# Altium project WiWi_SDR.PrjPcb (part 5 of 5)
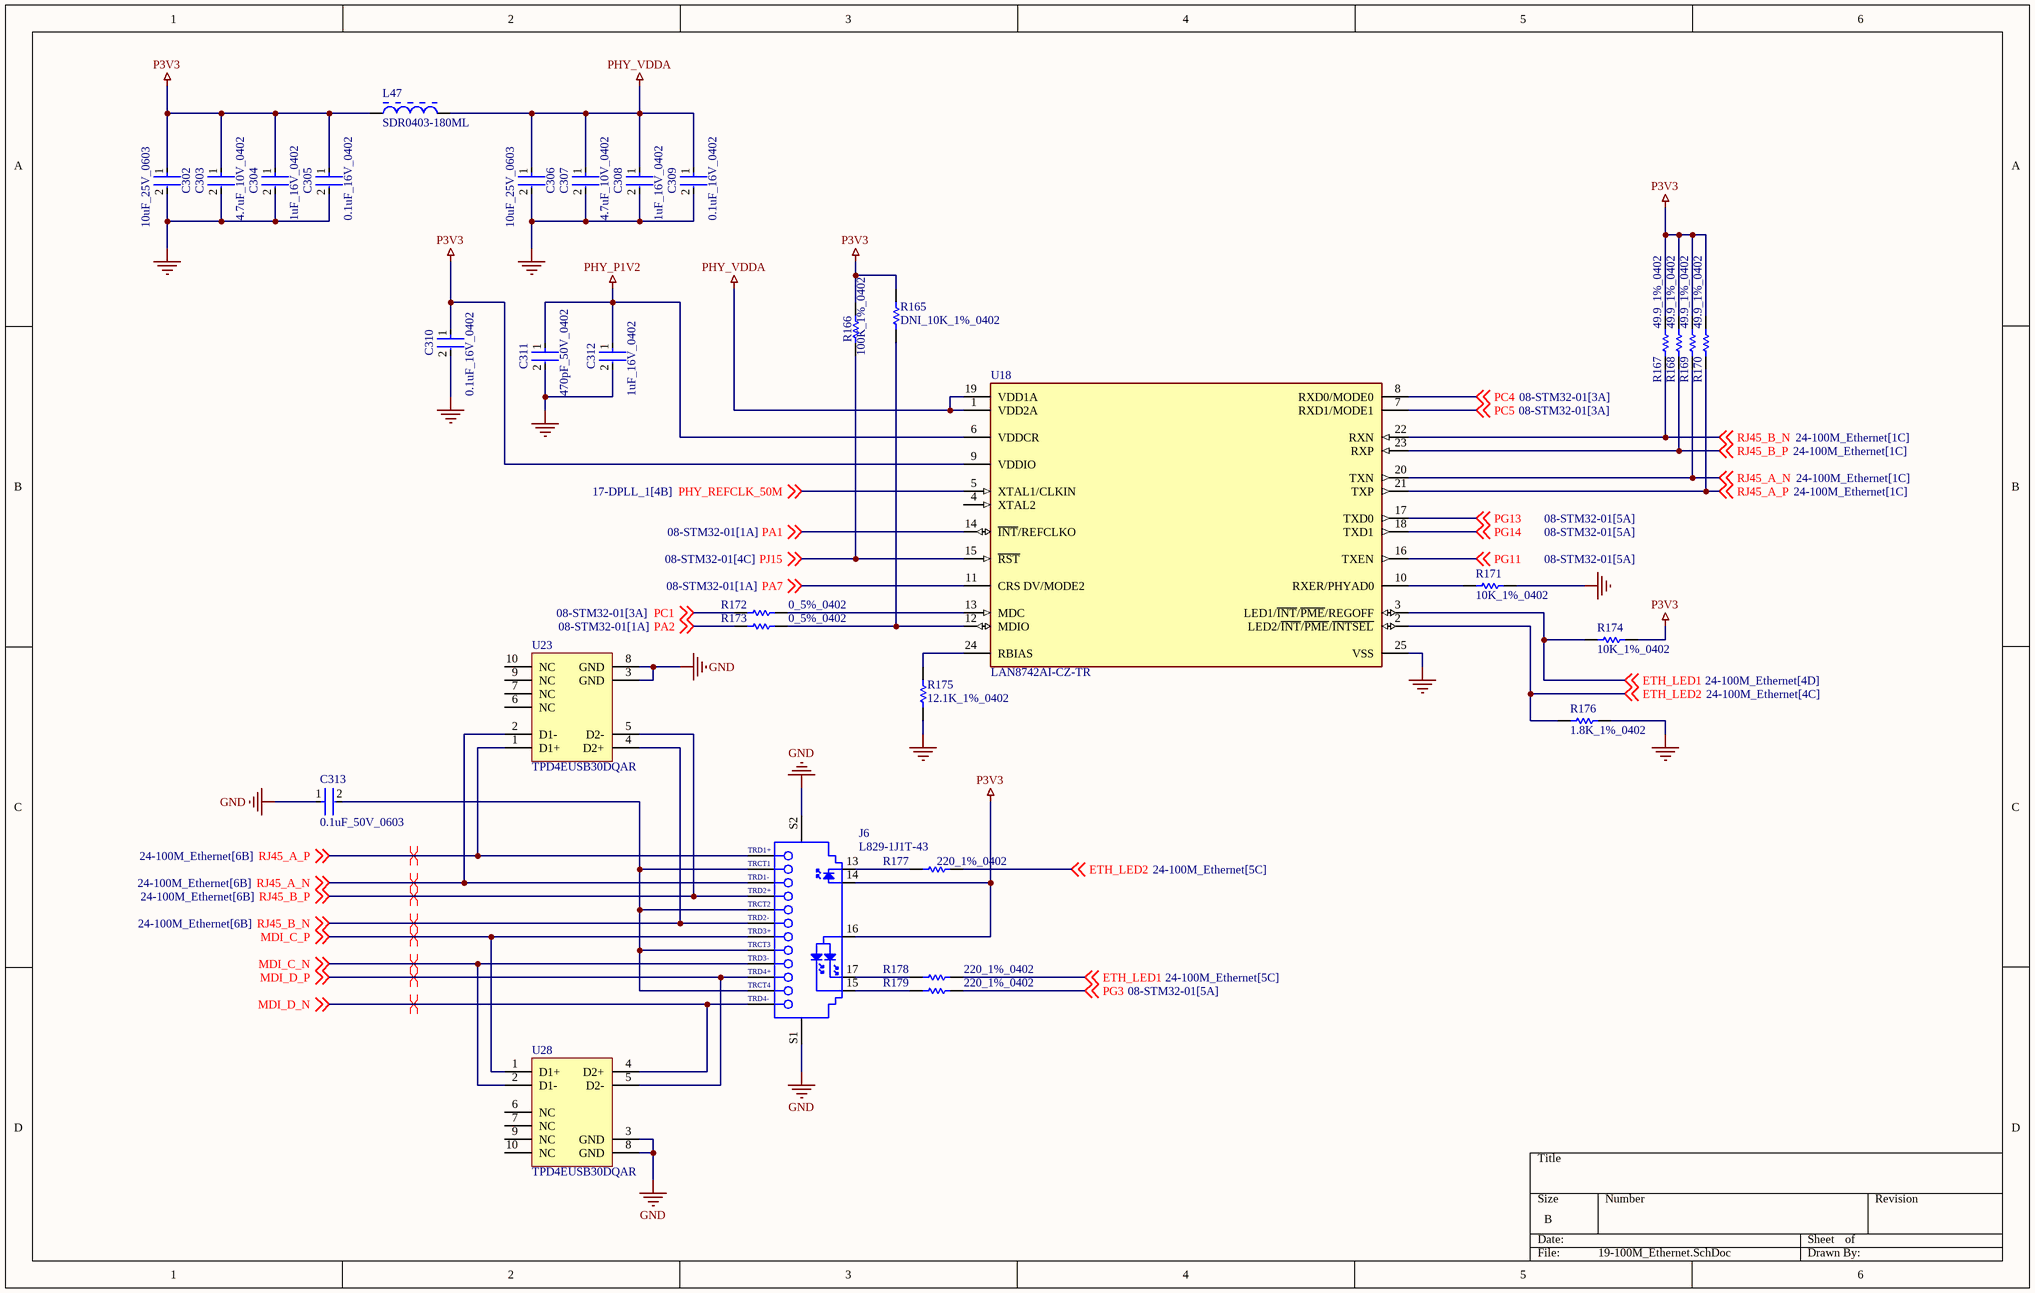
[diagram p16: 19-100M_Ethernet.SchDoc]

## Nets that join several sheets
FPGA_P2V5: 12-FPGA_Power (6 pins), 17-ECP5_FPGA_2 (14 pins)
FPGA_VCC: 11-Power (5 pins), 17-ECP5_FPGA_2 (15 pins)
GND: 01-Antennas (28 pins), 02-RCB_Header (C208.2 R41.1 SW1.1), 04-AT86RF215IQ (39 pins), 05-AT86RF215IQ-FEM (57 pins), 06-SX1276 (31 pins), 07-TCXO_Crystal (12 pins), 08-STM32-01 (P5.1 P5.2 Q5.2), 10-USB-Prog (20 pins), 11-Power (38 pins), 12-FPGA_Power (11 pins), 13-ESP32S3 (37 pins), 14-DPLL_1 (57 pins), 16-ECP5_FPGA_1 (7 pins), 17-ECP5_FPGA_2 (61 pins), 18-USB_HS (11 pins), 19-100M_Ethernet (22 pins)
P1V8: 11-Power (5 pins), 18-USB_HS (C300.1 C301.1 U3.28 U3.30)
P3V3: 01-Antennas (8 pins), 02-RCB_Header (R22.2 SW2.2), 04-AT86RF215IQ (7 pins), 05-AT86RF215IQ-FEM (16 pins), 06-SX1276 (16 pins), 07-TCXO_Crystal (12 pins), 08-STM32-01 (D2.2 R20.2), 11-Power (11 pins), 12-FPGA_Power (7 pins), 13-ESP32S3 (20 pins), 14-DPLL_1 (16 pins), 16-ECP5_FPGA_1 (C184.1 D1.2 U15.1), 17-ECP5_FPGA_2 (40 pins), 18-USB_HS (7 pins), 19-100M_Ethernet (16 pins)
VIN: 05-AT86RF215IQ-FEM (5 pins), 10-USB-Prog (6 pins), 11-Power (23 pins)
32768HZ_OUT: 07-TCXO_Crystal (Y2.2), 08-STM32-01 (U7.C2)
BOOT: 02-RCB_Header (R41.2 SW2.1), 08-STM32-01 (R42.2 U7.E8)
DPLL_A0: 08-STM32-01 (U7.P15), 14-DPLL_1 (R35.1 U4.L3 U4.M3)
DPLL_A1: 08-STM32-01 (U7.U16), 14-DPLL_1 (R36.1 U4.M2)
DPLL_CLKIN_1_N: 14-DPLL_1 (U4.C2), 16-ECP5_FPGA_1 (U11.T15)
DPLL_CLKIN_2_N: 14-DPLL_1 (U4.D2), 16-ECP5_FPGA_1 (U11.R15)
DPLL_CLKIN_2_P: 14-DPLL_1 (U4.D1), 16-ECP5_FPGA_1 (U11.A8)
DPLL_CLKIN_3_N: 14-DPLL_1 (U4.E2), 16-ECP5_FPGA_1 (U11.P14)
DPLL_CLKIN_3_P: 14-DPLL_1 (U4.E1), 16-ECP5_FPGA_1 (U11.E5)
DPLL_CLKIN_7_P: 13-ESP32S3 (U24.14), 14-DPLL_1 (U4.J1)
DPLL_CLKOUT0_P: 14-DPLL_1 (U4.A8), 16-ECP5_FPGA_1 (R111.1)
DPLL_CLKOUT1_P: 13-ESP32S3 (R124.1), 14-DPLL_1 (U4.A9)
DPLL_CLKOUT2_P: 14-DPLL_1 (U4.A11), 16-ECP5_FPGA_1 (R145.1)
DPLL_CLKOUT3_P: 04-AT86RF215IQ (R6.1), 14-DPLL_1 (U4.A12)
DPLL_CLKOUT4_P: 06-SX1276 (U12.5), 14-DPLL_1 (U4.M12)
DPLL_CLKOUT5_P: 14-DPLL_1 (U4.M11), 16-ECP5_FPGA_1 (R147.1)
DPLL_CLKOUT10_P: 14-DPLL_1 (U4.H12), 18-USB_HS (R163.1)
DPLL_GPIO4: 14-DPLL_1 (U4.B10), 16-ECP5_FPGA_1 (U11.A10)
DPLL_GPIO5: 14-DPLL_1 (U4.D11), 16-ECP5_FPGA_1 (U11.B10)
DPLL_GPIO10_CLK14: 14-DPLL_1 (U4.M5), 16-ECP5_FPGA_1 (U11.C10)
DPLL_RESET: 08-STM32-01 (U7.E12), 14-DPLL_1 (C7.1 R64.2 U4.L10)
DPLL_SCL: 08-STM32-01 (U7.D5), 14-DPLL_1 (R25.2 U4.K2)
DPLL_SDA: 08-STM32-01 (U7.C5), 14-DPLL_1 (R30.2 U4.L2)
DPLL_XO: 07-TCXO_Crystal (R15.2), 14-DPLL_1 (U4.A1)
ESP_ANT: 01-Antennas (U27.5), 13-ESP32S3 (C317.2 R90.2)
ESP_FPGA_SPARE1: 13-ESP32S3 (U24.16), 16-ECP5_FPGA_1 (U11.A14)
ESP_FPGA_SPARE2: 13-ESP32S3 (U24.17), 16-ECP5_FPGA_1 (U11.A15)
ESP_FPGA_SPARE3: 13-ESP32S3 (U24.18), 16-ECP5_FPGA_1 (U11.B14)
ESP_FPGA_SPARE4: 13-ESP32S3 (U24.12), 16-ECP5_FPGA_1 (U11.E16)
ESP_FPGA_SPARE5: 13-ESP32S3 (U24.13), 16-ECP5_FPGA_1 (U11.C15)
ESP_FPGA_SPARE6: 13-ESP32S3 (U24.15), 16-ECP5_FPGA_1 (U11.C16)
ESP_STM_SPARE1: 08-STM32-01 (U7.F3), 13-ESP32S3 (U24.38)
ESP_STM_SPARE2: 08-STM32-01 (U7.H2), 13-ESP32S3 (U24.39)
ESP_STM_SPARE3: 08-STM32-01 (U7.H3), 13-ESP32S3 (U24.40)
ESP_STM_SPARE4: 08-STM32-01 (U7.P5), 13-ESP32S3 (U24.41)
ESPTX_GPIO0: 08-STM32-01 (U7.U6), 13-ESP32S3 (6 pins)
ESPTX_GPIO14: 13-ESP32S3 (U24.19), 16-ECP5_FPGA_1 (U11.E9)
ESPTX_GPIO17: 13-ESP32S3 (U24.23), 16-ECP5_FPGA_1 (U11.A9)
ESPTX_RST: 08-STM32-01 (U7.D13), 13-ESP32S3 (C197.1 R123.1 SW4.2 U24.4)
ESPTX_USB_D_N: 10-USB-Prog (J4.2 U8.1), 13-ESP32S3 (R128.2)
ESPTX_USB_D_P: 10-USB-Prog (J4.3 U8.2), 13-ESP32S3 (R129.2)
FPGA_DONE: 08-STM32-01 (U7.M4), 17-ECP5_FPGA_2 (P6.2 R151.1 U11.P9)
FPGA_INITN: 08-STM32-01 (U7.A11), 17-ECP5_FPGA_2 (P6.4 R152.1 U11.T9)
FPGA_PROGRAMN: 08-STM32-01 (U7.C15), 17-ECP5_FPGA_2 (P6.6 R153.1 U11.R9)
FPGA_SCL: 08-STM32-01 (U7.B15), 16-ECP5_FPGA_1 (U11.C5), 17-ECP5_FPGA_2 (R157.1)
FPGA_SDA: 08-STM32-01 (U7.B3), 16-ECP5_FPGA_1 (U11.D5), 17-ECP5_FPGA_2 (R156.1)
FPGA_TCK: 08-STM32-01 (U7.U3), 17-ECP5_FPGA_2 (P6.7 U11.T10)
FPGA_TDI: 08-STM32-01 (U7.E13), 17-ECP5_FPGA_2 (P6.3 U11.R11)
FPGA_TDO: 08-STM32-01 (U7.M3), 17-ECP5_FPGA_2 (P6.5 U11.M10)
FPGA_TMS: 08-STM32-01 (U7.B14), 17-ECP5_FPGA_2 (P6.8 U11.T11)
FPGA_USER_SCL: 08-STM32-01 (U7.A12), 16-ECP5_FPGA_1 (U11.C9), 17-ECP5_FPGA_2 (R155.1)
FPGA_USER_SDA: 08-STM32-01 (U7.B12), 16-ECP5_FPGA_1 (U11.B9), 17-ECP5_FPGA_2 (R154.1)
NRST: 02-RCB_Header (C208.1 R22.1 SW1.2), 08-STM32-01 (U7.K1)
PA1: 08-STM32-01 (U7.N4), 19-100M_Ethernet (U18.14)
PA2: 08-STM32-01 (U7.N3), 19-100M_Ethernet (R173.1)
PA3: 08-STM32-01 (U7.U2), 18-USB_HS (U3.3)
PA5: 08-STM32-01 (U7.T3), 18-USB_HS (U3.1)
PA7: 08-STM32-01 (U7.R5), 19-100M_Ethernet (U18.11)
PB0: 08-STM32-01 (U7.U5), 18-USB_HS (U3.4)
PB1: 08-STM32-01 (U7.T5), 18-USB_HS (U3.5)
PB5: 08-STM32-01 (U7.A5), 18-USB_HS (U3.13)
PB10: 08-STM32-01 (U7.P11), 18-USB_HS (U3.6)
PB11: 08-STM32-01 (U7.P12), 18-USB_HS (U3.7)
PB12: 08-STM32-01 (U7.T14), 18-USB_HS (U3.9)
PB13: 08-STM32-01 (U7.U14), 18-USB_HS (U3.10)
PC0: 08-STM32-01 (U7.L2), 18-USB_HS (U3.29)
PC1: 08-STM32-01 (U7.M2), 19-100M_Ethernet (R172.1)
PC4: 08-STM32-01 (U7.T4), 19-100M_Ethernet (U18.8)
PC5: 08-STM32-01 (U7.U4), 19-100M_Ethernet (U18.7)
PD9: 08-STM32-01 (U7.T17), 14-DPLL_1 (R43.2 U4.A10)
PD10: 08-STM32-01 (U7.T16), 14-DPLL_1 (R45.2 U4.J11)
PD11: 08-STM32-01 (U7.R15), 16-ECP5_FPGA_1 (U11.T8), 17-ECP5_FPGA_2 (R112.1 R120.2)
PD12: 08-STM32-01 (U7.R16), 16-ECP5_FPGA_1 (U11.T7), 17-ECP5_FPGA_2 (R118.1 R148.2)
PD13: 08-STM32-01 (U7.R17), 16-ECP5_FPGA_1 (U11.N7), 17-ECP5_FPGA_2 (R115.1 R149.2)
PD14: 08-STM32-01 (U7.P16), 14-DPLL_1 (R57.2 U4.A5)
PF7: 08-STM32-01 (U7.K3), 16-ECP5_FPGA_1 (U11.M7), 17-ECP5_FPGA_2 (R116.1 R121.2)
PF10: 08-STM32-01 (U7.L3), 17-ECP5_FPGA_2 (R117.1 R119.2 U11.N9)
PG3: 08-STM32-01 (U7.H15), 19-100M_Ethernet (R179.2)
PG6: 08-STM32-01 (U7.G15), 16-ECP5_FPGA_1 (U11.N8), 17-ECP5_FPGA_2 (R114.1 R150.2)
PG11: 08-STM32-01 (U7.B9), 19-100M_Ethernet (U18.16)
PG13: 08-STM32-01 (U7.D9), 19-100M_Ethernet (U18.17)
PG14: 08-STM32-01 (U7.D8), 19-100M_Ethernet (U18.18)
PH4: 08-STM32-01 (U7.P3), 18-USB_HS (U3.2)
PH10: 04-AT86RF215IQ (R12.1), 08-STM32-01 (U7.P13)
PH11: 04-AT86RF215IQ (R19.1), 08-STM32-01 (U7.P14)
PH12: 04-AT86RF215IQ (R1.1 R2.2), 08-STM32-01 (U7.R14)
PHY_REFCLK_50M: 14-DPLL_1 (U4.M9), 19-100M_Ethernet (U18.5)
PI11: 08-STM32-01 (U7.F4), 18-USB_HS (U3.31)
PJ4: 08-STM32-01 (U7.U7), 18-USB_HS (R164.2 U3.27)
PJ6: 08-STM32-01 (U7.N15), 18-USB_HS (U3.23)
PJ15: 08-STM32-01 (U7.B10), 19-100M_Ethernet (R166.1 U18.15)
RF_SEL_0: 01-Antennas (U26.4), 16-ECP5_FPGA_1 (U11.L16)
RF_SEL_1: 01-Antennas (U27.4), 16-ECP5_FPGA_1 (U11.N16)
RF_SEL_2: 01-Antennas (U6.4), 16-ECP5_FPGA_1 (U11.M16)
RF_SEL_3: 01-Antennas (U29.4), 16-ECP5_FPGA_1 (U11.K16)
SDR_RX_SUBG_N: 04-AT86RF215IQ (R9.1 U1.30), 16-ECP5_FPGA_1 (U11.G2)
SDR_RX_SUBG_P: 04-AT86RF215IQ (R9.2 U1.31), 16-ECP5_FPGA_1 (U11.F1)
SDR_RX_WIFI_N: 04-AT86RF215IQ (R10.1 U1.35), 16-ECP5_FPGA_1 (U11.C2)
SDR_RX_WIFI_P: 04-AT86RF215IQ (R10.2 U1.36), 16-ECP5_FPGA_1 (U11.C1)
SDR_RXCLK_N: 04-AT86RF215IQ (R4.1 U1.34), 16-ECP5_FPGA_1 (U11.L2)
SDR_RXCLK_P: 04-AT86RF215IQ (R4.2 U1.33), 16-ECP5_FPGA_1 (U11.L1)
SDR_SUBG_RF: 01-Antennas (U6.3), 05-AT86RF215IQ-FEM (U34.5)
SDR_SUBG_RF_CHIP: 04-AT86RF215IQ (C20.2), 05-AT86RF215IQ-FEM (U32.5)
SDR_TX_N: 04-AT86RF215IQ (R7.1 U1.27), 16-ECP5_FPGA_1 (U11.D1)
SDR_TX_P: 04-AT86RF215IQ (R7.2 U1.28), 16-ECP5_FPGA_1 (U11.E2)
SDR_TXCLK_N: 04-AT86RF215IQ (R5.1 U1.25), 16-ECP5_FPGA_1 (U11.P2)
SDR_TXCLK_P: 04-AT86RF215IQ (R5.2 U1.26), 16-ECP5_FPGA_1 (U11.N1)
SDR_WIFI_RF: 01-Antennas (U26.1), 05-AT86RF215IQ-FEM (U35.5)
SDR_WIFI_RF_CHIP: 04-AT86RF215IQ (C21.1), 05-AT86RF215IQ-FEM (U33.5)
SiT5501_PLL_SCL: 07-TCXO_Crystal (R96.1 Y4.3), 08-STM32-01 (U7.M14)
SiT5501_PLL_SDA: 07-TCXO_Crystal (R95.1 Y4.2), 08-STM32-01 (U7.L14)
SPI1_MISO: 08-STM32-01 (U7.R3), 16-ECP5_FPGA_1 (U11.B6)
SPI1_MOSI: 08-STM32-01 (U7.C11), 16-ECP5_FPGA_1 (U11.C6)
SPI1_SCK: 08-STM32-01 (U7.C6), 16-ECP5_FPGA_1 (U11.E4)
SPI2_MISO: 08-STM32-01 (U7.T15), 16-ECP5_FPGA_1 (U11.A4)
SPI2_MOSI: 08-STM32-01 (U7.C14), 16-ECP5_FPGA_1 (U11.E7)
SPI2_SCK: 08-STM32-01 (U7.A15), 16-ECP5_FPGA_1 (U11.B3)
SPI3_MISO: 08-STM32-01 (U7.B13), 16-ECP5_FPGA_1 (U11.E6)
SPI3_MOSI: 08-STM32-01 (U7.B11), 16-ECP5_FPGA_1 (U11.D7)
SPI3_SCK: 08-STM32-01 (U7.A13), 16-ECP5_FPGA_1 (U11.A6)
SPI4_MISO: 08-STM32-01 (U7.D1), 16-ECP5_FPGA_1 (U11.A3)
SPI4_MOSI: 08-STM32-01 (U7.E5), 16-ECP5_FPGA_1 (U11.D6)
SPI4_SCK: 08-STM32-01 (U7.C3), 16-ECP5_FPGA_1 (U11.A2)
SPI5_MISO: 04-AT86RF215IQ (R14.1), 06-SX1276 (R48.2), 08-STM32-01 (U7.K4), 13-ESP32S3 (U24.10)
SPI5_MOSI: 04-AT86RF215IQ (R13.1), 06-SX1276 (R46.2), 08-STM32-01 (U7.L4), 13-ESP32S3 (U24.11)
SPI5_NSS: 06-SX1276 (R50.2), 08-STM32-01 (U7.J15)
SPI5_SCK: 04-AT86RF215IQ (R11.1), 06-SX1276 (R32.2), 08-STM32-01 (U7.J14), 13-ESP32S3 (U24.9)
STM32_CORE_16M: 07-TCXO_Crystal (R31.2), 08-STM32-01 (U7.J2)
STM_FPGA_SPARE1: 08-STM32-01 (U7.H17), 16-ECP5_FPGA_1 (U11.D4)
STM_FPGA_SPARE2: 08-STM32-01 (U7.B16), 16-ECP5_FPGA_1 (U11.C4)
STM_FPGA_SPARE3: 08-STM32-01 (U7.B17), 16-ECP5_FPGA_1 (U11.B4)
STM_FPGA_SPARE4: 08-STM32-01 (U7.H16), 16-ECP5_FPGA_1 (U11.C7)
STM_FPGA_SPARE5: 08-STM32-01 (U7.T11), 16-ECP5_FPGA_1 (U11.B7), 17-ECP5_FPGA_2 (R158.1)
STM_FPGA_SPARE6: 08-STM32-01 (U7.U13), 16-ECP5_FPGA_1 (U11.A7), 17-ECP5_FPGA_2 (R159.1)
SUBG_FEM_CPS: 05-AT86RF215IQ-FEM (R192.2), 16-ECP5_FPGA_1 (U11.C12)
SUBG_FEM_CSD: 05-AT86RF215IQ-FEM (R194.2), 16-ECP5_FPGA_1 (U11.A12)
SUBG_FEM_CTX: 05-AT86RF215IQ-FEM (R193.2), 16-ECP5_FPGA_1 (U11.A11)
SUBG_FEM_SEL0: 05-AT86RF215IQ-FEM (U32.4), 16-ECP5_FPGA_1 (U11.D11)
SUBG_FEM_SEL1: 05-AT86RF215IQ-FEM (U34.4), 16-ECP5_FPGA_1 (U11.F16)
SX1276_ANT: 01-Antennas (U29.5), 06-SX1276 (U20.5)
SX1276_DIO0: 06-SX1276 (R23.1), 08-STM32-01 (U7.N14), 14-DPLL_1 (U4.B2), 16-ECP5_FPGA_1 (U11.D9)
SX1276_HF_TXRX_CTRL: 06-SX1276 (R62.1 U22.4), 08-STM32-01 (U7.B8)
SX1276_HFLF_CTRL: 06-SX1276 (R60.1 U20.4), 08-STM32-01 (U7.C7)
SX1276_LF_TXRX_CTRL: 06-SX1276 (R61.1 U21.4), 08-STM32-01 (U7.C8)
SX1276_RST: 06-SX1276 (U12.7), 08-STM32-01 (U7.B7)
TIM2_CH1: 08-STM32-01 (U7.A14), 14-DPLL_1 (U4.B1)
TIM2_CH2: 08-STM32-01 (U7.R6), 14-DPLL_1 (U4.C1)
TIM2_ETR: 08-STM32-01 (U7.N5), 14-DPLL_1 (U4.A6)
UART4_RX: 08-STM32-01 (U7.E2), 13-ESP32S3 (R143.1)
UART4_TX: 08-STM32-01 (U7.D16), 13-ESP32S3 (R127.1)
USBPROG_D_N: 08-STM32-01 (U7.E17), 10-USB-Prog (J2.A7 J2.B7 U13.1)
USBPROG_D_P: 08-STM32-01 (U7.E16), 10-USB-Prog (J2.A6 J2.B6 U13.2)
WIFI_FEM_CHL: 05-AT86RF215IQ-FEM (R199.2), 16-ECP5_FPGA_1 (U11.A13)
WIFI_FEM_CPS: 05-AT86RF215IQ-FEM (R196.2), 16-ECP5_FPGA_1 (U11.B13)
WIFI_FEM_CRX: 05-AT86RF215IQ-FEM (R197.2), 16-ECP5_FPGA_1 (U11.D16)
WIFI_FEM_CSD: 05-AT86RF215IQ-FEM (R195.2), 16-ECP5_FPGA_1 (U11.E13)
WIFI_FEM_CTX: 05-AT86RF215IQ-FEM (R198.2), 16-ECP5_FPGA_1 (U11.D13)
WIFI_FEM_SEL0: 05-AT86RF215IQ-FEM (U33.4), 16-ECP5_FPGA_1 (U11.B15)
WIFI_FEM_SEL1: 05-AT86RF215IQ-FEM (U35.4), 16-ECP5_FPGA_1 (U11.B16)

## Assembly variants
845-XXXXX_PCBA_projectname: all parts fitted